# EAGLE design 32k extender-v1.1 (EAGLE 8.3.1)
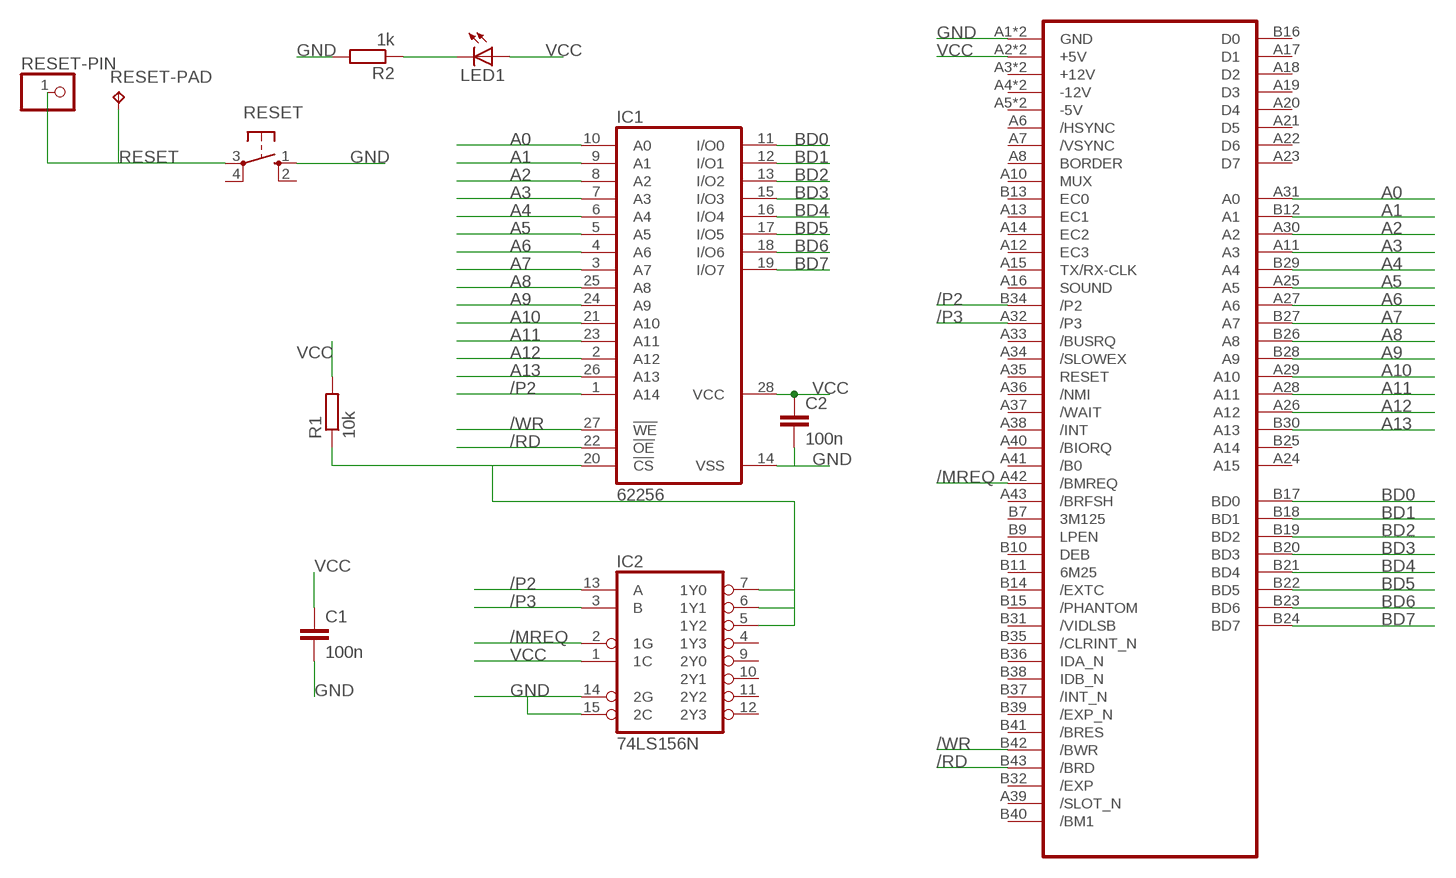
[diagram p0: schematic, sheet 1]

## Parts
C1  100n  C2.5/2  [C2.5-2]
C2  100n  C2.5/2  [C2.5-2]
IC1  62256  62256P  [DIL28-6]
IC2  74LS156N  [DIL16]
LED1  LED5MM  [LED5MM]
R1  10k  R-EU_0204/5  [0204/5]
R2  1k  R-EU_0204/5  [0204/5]
RESET  10-XX  [B3F-10XX]
RESET-PAD  TPTP13SQ  [TP13SQ]
RESET-PIN  PINHD-1X1  [1X01]
U$1  TVC-EXP-HBA  [TVC-EXP-EDGE]

## Nets
/MREQ: IC2.2(1G) U$1.A42(/BMREQ)
/P2: IC1.1(A14) IC2.13(A) U$1.B34(/P2)
/P3: IC2.3(B) U$1.A32(/P3)
/RD: IC1.22(!OE) U$1.B43(/BRD)
/WR: IC1.27(!WE) U$1.B42(/BWR)
A0: IC1.10(A0) U$1.A31(A0)
A1: IC1.9(A1) U$1.B12(A1)
A2: IC1.8(A2) U$1.A30(A2)
A3: IC1.7(A3) U$1.A11(A3)
A4: IC1.6(A4) U$1.B29(A4)
A5: IC1.5(A5) U$1.A25(A5)
A6: IC1.4(A6) U$1.A27(A6)
A7: IC1.3(A7) U$1.B27(A7)
A8: IC1.25(A8) U$1.B26(A8)
A9: IC1.24(A9) U$1.B28(A9)
A10: IC1.21(A10) U$1.A29(A10)
A11: IC1.23(A11) U$1.A28(A11)
A12: IC1.2(A12) U$1.A26(A12)
A13: IC1.26(A13) U$1.B30(A13)
BD0: IC1.11(I/O0) U$1.B17(BD0)
BD1: IC1.12(I/O1) U$1.B18(BD1)
BD2: IC1.13(I/O2) U$1.B19(BD2)
BD3: IC1.15(I/O3) U$1.B20(BD3)
BD4: IC1.16(I/O4) U$1.B21(BD4)
BD5: IC1.17(I/O5) U$1.B22(BD5)
BD6: IC1.18(I/O6) U$1.B23(BD6)
BD7: IC1.19(I/O7) U$1.B24(BD7)
GND [power]: C1.2 C2.2 IC1.14(VSS) IC2.14(2G) IC2.15(2C) R2.2 RESET.1(S) U$1.A1(GND) U$1.B1(GND)
N$1: IC1.20(!CS) IC2.5(1Y2) IC2.6(1Y1) IC2.7(1Y0) R1.1
N$3: LED1.K(C) R2.1
RESET: RESET-PAD.TP RESET-PIN.1 RESET.3(P)
VCC [power]: C1.1 C2.1 IC1.28(VCC) IC2.1(1C) LED1.A R1.2 U$1.A2(+5V) U$1.B2(+5V)
Unconnected: IC2.4(1Y3) IC2.9(2Y0) IC2.10(2Y1) IC2.11(2Y2) IC2.12(2Y3) RESET.2(S1) RESET.4(P1) U$1.A3(+12V) U$1.A4(-12V) U$1.A5(-5V) U$1.A6(/HSYNC) U$1.A7(/VSYNC) U$1.A8(BORDER) U$1.A10(MUX) U$1.A12(EC3) U$1.A13(EC1) U$1.A14(EC2) U$1.A15(TX/RX-CLK) U$1.A16(SOUND) U$1.A17(D1) U$1.A18(D2) U$1.A19(D3) U$1.A20(D4) U$1.A21(D5) U$1.A22(D6) U$1.A23(D7) U$1.A24(A15) U$1.A33(/BUSRQ) U$1.A34(/SLOWEX) U$1.A35(RESET) U$1.A36(/NMI) U$1.A37(/WAIT) U$1.A38(/INT) U$1.A39(/SLOT_N) U$1.A40(/BIORQ) U$1.A41(/B0) U$1.A43(/BRFSH) U$1.B3(+12V) U$1.B4(-12V) U$1.B5(-5V) U$1.B7(3M125) U$1.B9(LPEN) U$1.B10(DEB) U$1.B11(6M25) U$1.B13(EC0) U$1.B14(/EXTC) U$1.B15(/PHANTOM) U$1.B16(D0) U$1.B25(A14) U$1.B31(/VIDLSB) U$1.B32(/EXP) U$1.B35(/CLRINT_N) U$1.B36(IDA_N) U$1.B37(/INT_N) U$1.B38(IDB_N) U$1.B39(/EXP_N) U$1.B40(/BM1) U$1.B41(/BRES)

## Power pins joined to a net without a drawn wire
GND: IC2.8(GND)
VCC: IC2.16(VCC)

## Library data of the parts
C1 C2 = capacitor-wima:C: CAPACITOR naming: grid - package width
IC1 = memory-hitachi:62256P: MEMORY; OC_FARNELL: unknown; OC_NEWARK: unknown
IC2 = 74xx-eu:74*156: Dual 2-line to 4-line DECODER/DEMULTIPLEXER
LED1 = led:LED: LED OSRAM: - CHIPLED LG R971, LG N971, LY N971, LG Q971, LY Q971, LO R971, LY R971 LH N974, LH R974 LS Q976, LO Q976, LY Q976 LO Q996 - Hyper CHIPLED LW Q18S LB Q993, LB Q99A, LB R99A - SideLED LS A670, LO A670, LY A670, LG A670, LP A670 LB A673, LV A673, LT A673, LW A673 LH A674 LY A675 LS A676, LA A676, LO A676, LY A676, LW A676 LS A679, LY A679, LG A679 - Hyper Micro SIDELED® LS Y876, LA Y876, LO Y876, LY Y876 LT Y87S - SmartLED LW L88C, LW L88S LB L89C, LB L89S, LG L890 LS L89K, LO L89K, LY L89K LS L896, LA L896, LO L896, LY L896 - TOPLED LS T670, LO T670, LY T670, LG T670, LP T670 LSG T670, LSP T670, LSY T670, LOP T670, LYG T670 LG T671, LOG T671, LSG T671 LB T673, LV T673, LT T673, LW T673 LH T674 LS T676, LA T676, LO T676, LY T676, LB T676, LH T676, LSB T676, LW T676 LB T67C, LV T67C, LT T67C, LS T67K, LO T67K, LY T67K, LW E67C LS E67B, LA E67B, LO E67B, LY E67B, LB E67C, LV E67C, LT E67C LW T67C LS T679, LY T679, LG T679 LS T770, LO T770, LY T770, LG T770, LP T770 LB T773, LV T773, LT T773, LW T773 LH T774 LS E675, LA E675, LY E675, LS T675 LS T776, LA T776, LO T776, LY T776, LB T776 LHGB T686 LT T68C, LB T68C - Hyper Mini TOPLED® LB M676 - Mini TOPLED Santana® LG M470 LS M47K, LO M47K, LY M47K Source: http://www.osram.convergy.de LUXEON: - LUMILED® LXK2-PW12-R00, LXK2-PW12-S00, LXK2-PW14-U00, LXK2-PW14-V00 LXK2-PM12-R00, LXK2-PM12-S00, LXK2-PM14-U00 LXK2-PE12-Q00, LXK2-PE12-R00, LXK2-PE12-S00, LXK2-PE14-T00, LXK2-PE14-U00 LXK2-PB12-K00, LXK2-PB12-L00, LXK2-PB12-M00, LXK2-PB14-N00, LXK2-PB14-P00, LXK2-PB14-Q00 LXK2-PR12-L00, LXK2-PR12-M00, LXK2-PR14-Q00, LXK2-PR14-R00 LXK2-PD12-Q00, LXK2-PD12-R00, LXK2-PD12-S00 LXK2-PH12-R00, LXK2-PH12-S00 LXK2-PL12-P00, LXK2-PL12-Q00, LXK2-PL12-R00 Source: www.luxeon.com KINGBRIGHT: KA-3528ASYC Source: www.kingbright.com
R1 R2 = resistor:R-EU_: RESISTOR, European symbol
RESET = switch-omron:10-XX: OMRON SWITCH; MPN: B3F-1000; OC_FARNELL: 176432; OC_NEWARK: 36M3542
RESET-PAD = testpad:TP: Test pad
RESET-PIN = pinhead:PINHD-1X1: PIN HEADER
U$1 = tvc-exp:TVC-EXP-HBA: Videoton TV-Computer 32k and 64k expansion port edge connector

## Net classes
1 power: width 0.508 mm, clearance 0.254 mm

## Board
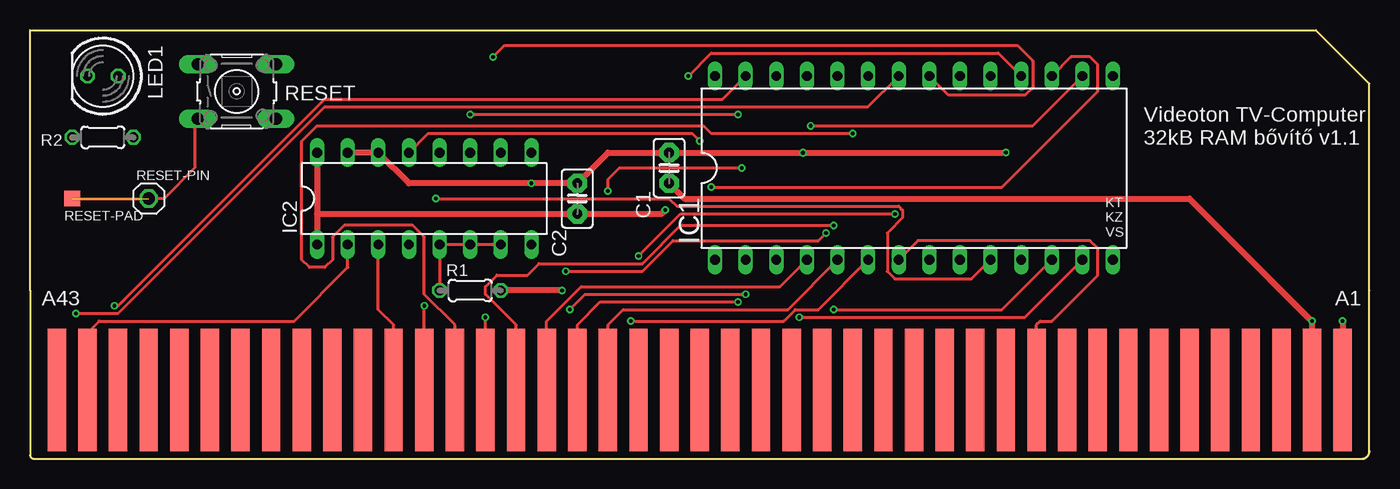
[diagram p1: board, top side]
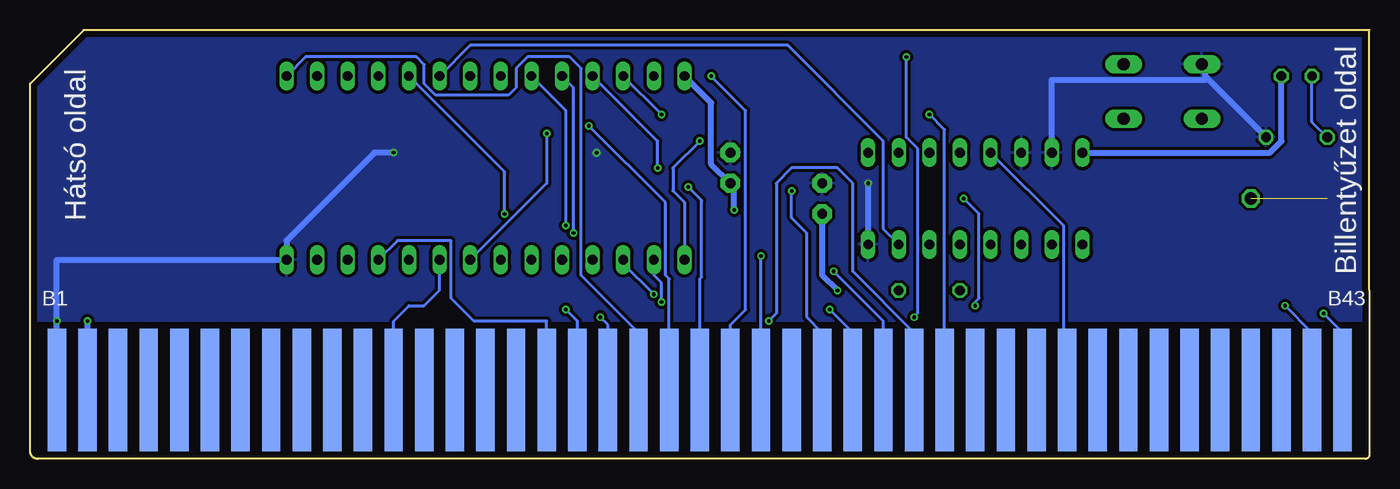
[diagram p2: board, bottom side, seen from below]

Size 111.12 x 35.56 mm. Coordinates in mm from the lower left corner, seen from the top.
Outline: 111.13,13.97 111.13,31.11 106.68,35.56 0,35.56 0,13.97
Copper layers (1*16): Top 0.035mm / dielectric 1.6mm / Bottom 0.035mm
Design rules "Elecrow_2-layer_PCB_eagle_rule *": minimum track width 10mil, minimum drill 12mil, track to track 6mil, track to pad 6mil, pad to pad 6mil, via to via 8mil, smd to smd 0mil, copper to edge 20mil, drill to drill 10mil, minimum pad ring 6mil, minimum via ring 6mil, stop-mask expansion 0mil, vias tented up to drill 100mil, thermal gap 10mil

### Footprints (pad centres in the part's own frame; a part is rotated, then mirrored left to right if it is on the bottom)
C2.5-2 = drill 0.813 pad 1.6 octagon: 1 -1.27,0; 2 1.27,0
DIL28-6 = drill 0.813 long: 1 -16.51,-7.62; 2 -13.97,-7.62; 3 -11.43,-7.62; 4 -8.89,-7.62; 5 -6.35,-7.62; 6 -3.81,-7.62; 7 -1.27,-7.62; 8 1.27,-7.62; 9 3.81,-7.62; 10 6.35,-7.62; 11 8.89,-7.62; 12 11.43,-7.62; 13 13.97,-7.62; 14 16.51,-7.62; 15 16.51,7.62; 16 13.97,7.62; 17 11.43,7.62; 18 8.89,7.62; 19 6.35,7.62; 20 3.81,7.62; 21 1.27,7.62; 22 -1.27,7.62; 23 -3.81,7.62; 24 -6.35,7.62; 25 -8.89,7.62; 26 -11.43,7.62; 27 -13.97,7.62; 28 -16.51,7.62
DIL16 = drill 0.813 long: 1 -8.89,-3.81; 2 -6.35,-3.81; 3 -3.81,-3.81; 4 -1.27,-3.81; 5 1.27,-3.81; 6 3.81,-3.81; 7 6.35,-3.81; 8 8.89,-3.81; 9 8.89,3.81; 10 6.35,3.81; 11 3.81,3.81; 12 1.27,3.81; 13 -1.27,3.81; 14 -3.81,3.81; 15 -6.35,3.81; 16 -8.89,3.81
LED5MM = drill 0.813 octagon: A -1.27,0; K 1.27,0
0204/5 = drill 0.813 octagon: 1 -2.54,0; 2 2.54,0
B3F-10XX = drill 1.016 long: 1 -3.251,2.261; 2 3.251,2.261; 3 -3.251,-2.261; 4 3.251,-2.261
TP13SQ = smd 1.3 x 1.3: TP 0,0
1X01 = drill 1.016 octagon: 1 0,0
TVC-EXP-EDGE = smd 1.524 x 10.16: A1 53.34,-5.715; A2 50.8,-5.715; A3 48.26,-5.715; A4 45.72,-5.715; A5 43.18,-5.715; A6 40.64,-5.715; A7 38.1,-5.715; A8 35.56,-5.715; A9 33.02,-5.715; A10 30.48,-5.715; A11 27.94,-5.715; A12 25.4,-5.715; A13 22.86,-5.715; A14 20.32,-5.715; A15 17.78,-5.715; A16 15.24,-5.715; A17 12.7,-5.715; A18 10.16,-5.715; A19 7.62,-5.715; A20 5.08,-5.715; A21 2.54,-5.715; A22 0,-5.715; A23 -2.54,-5.715; A24 -5.08,-5.715; A25 -7.62,-5.715; A26 -10.16,-5.715; A27 -12.7,-5.715; A28 -15.24,-5.715; A29 -17.78,-5.715; A30 -20.32,-5.715; A31 -22.86,-5.715; A32 -25.4,-5.715; A33 -27.94,-5.715; A34 -30.48,-5.715; A35 -33.02,-5.715; A36 -35.56,-5.715; A37 -38.1,-5.715; A38 -40.64,-5.715; A39 -43.18,-5.715; A40 -45.72,-5.715; A41 -48.26,-5.715; A42 -50.8,-5.715; A43 -53.34,-5.715 | smd 1.524 x 10.16 bottom: B1 53.34,-5.715; B2 50.8,-5.715; B3 48.26,-5.715; B4 45.72,-5.715; B5 43.18,-5.715; B6 40.64,-5.715; B7 38.1,-5.715; B8 35.56,-5.715; B9 33.02,-5.715; B10 30.48,-5.715; B11 27.94,-5.715; B12 25.4,-5.715; B13 22.86,-5.715; B14 20.32,-5.715; B15 17.78,-5.715; B16 15.24,-5.715; B17 12.7,-5.715; B18 10.16,-5.715; B19 7.62,-5.715; B20 5.08,-5.715; B21 2.54,-5.715; B22 0,-5.715; B23 -2.54,-5.715; B24 -5.08,-5.715; B25 -7.62,-5.715; B26 -10.16,-5.715; B27 -12.7,-5.715; B28 -15.24,-5.715; B29 -17.78,-5.715; B30 -20.32,-5.715; B31 -22.86,-5.715; B32 -25.4,-5.715; B33 -27.94,-5.715; B34 -30.48,-5.715; B35 -33.02,-5.715; B36 -35.56,-5.715; B37 -38.1,-5.715; B38 -40.64,-5.715; B39 -43.18,-5.715; B40 -45.72,-5.715; B41 -48.26,-5.715; B42 -50.8,-5.715; B43 -53.34,-5.715

### Placement (x,y rotation side)
C1  53.02,24.13 90 top
C2  45.4,21.59 90 top
IC1  73.34,24.13 0 top
IC2  32.7,21.59 0 top
LED1  6.03,31.75 180 top
R1  36.51,13.97 0 top
R2  6.03,26.67 0 top
RESET  17.15,30.48 0 top
RESET-PAD  3.49,21.59 0 top
RESET-PIN  9.84,21.59 0 top
U$1  55.56,11.43 0 top

### Tracks (layer width: path | path; a pad name or v marks a point on that pad's centre or on a via)
/MREQ
  Top 0.254: IC2.2 26.35,15.88 21.91,11.43 5.71,11.43 4.76,10.48 U$1.A42
/P2  (via drill 0.3)
  Top 0.254: v55.56,26.35 54.93,26.99 33.02,26.99 IC2.13
  Bottom 0.254: IC1.1 56.83,21.27 57.78,22.23 57.78,24.13 v55.56,26.35 | IC2.13 25.4,19.37 25.4,5.71 25.08,5.4 U$1.B34
/P3
  Top 0.254: IC2.3 28.89,12.38 30.16,11.11 U$1.A32
/RD  (via drill 0.3)
  Top 0.254: IC1.22 69.53,29.21 24.45,29.21 7.3,12.06 v3.81,12.06
  Bottom 0.254: v3.81,12.06 2.22,10.48 U$1.B43
/WR  (via drill 0.3)
  Top 0.254: IC1.27 57.47,29.84 24.45,29.84 7.3,12.7 v6.98,12.7
  Bottom 0.254: v6.98,12.7 4.76,10.48 U$1.B42
A0  (via drill 0.3)
  Top 0.254: IC1.10 78.11,14.92 71.75,14.92 71.12,15.56 71.12,18.73 72.39,20 72.39,20.64 72.07,20.95 53.66,20.95 53.02,21.59 v33.66,21.59 | v32.7,12.7 32.7,9.53 32.38,5.4 32.7,5.4 U$1.A31
  Bottom 0.254: v33.66,21.59 32.38,20.32 32.38,13.34 32.7,13.02 v32.7,12.7
A1
  Bottom 0.254: IC1.9 77.15,13.97 78.42,12.7 79.69,12.7 80.96,11.43 U$1.B12
A2  (via drill 0.3)
  Top 0.254: v68.26,26.99 56.52,26.99 55.88,27.62 23.81,27.62 22.54,26.35 22.54,16.51 23.18,15.88 24.45,15.88 25.08,16.51 25.08,18.41 26.03,19.37 31.75,19.37 32.7,18.41 32.7,13.65 35.24,11.11 U$1.A30
  Bottom 0.254: IC1.8 68.26,22.86 v68.26,26.99
A3
  Top 0.254: IC1.7 73.66,18.1 87.95,18.1 88.58,17.46 88.58,15.24 84.77,11.43 83.82,11.43 83.5,11.11 U$1.A11
A4  (via drill 0.3)
  Top 0.254: IC1.6 65.41,12.38 63.5,12.38 62.55,11.43 v49.85,11.43
  Bottom 0.254: v49.85,11.43 49.21,12.06 49.21,22.86 47.94,24.13 44.13,24.13 42.86,22.86 42.86,15.56 37.78,10.48 U$1.B29
A5
  Top 0.254: IC1.5 62.86,12.38 49.21,12.38 47.94,11.11 U$1.A25
A6
  Top 0.254: IC1.4 62.23,14.29 45.72,14.29 42.86,11.43 U$1.A27
A7  (via drill 0.3)
  Top 0.254: v44.77,12.38 46.04,13.65 v59.37,13.65
  Bottom 0.254: IC1.3 61.91,16.19 v59.37,13.65 | v44.77,12.38 42.86,10.48 U$1.B27
A8  (via drill 0.3)
  Top 0.254: v59.06,24.13 48.89,24.13 47.94,23.18 v47.94,22.23
  Bottom 0.254: IC1.25 59.06,26.35 v59.06,24.13 | v47.94,22.23 47.94,20 46.67,18.73 46.67,11.75 45.4,10.48 U$1.B26
A9  (via drill 0.3)
  Top 0.254: v66.04,18.73 65.41,18.1 53.34,18.1 50.8,15.56 v44.45,15.56
  Bottom 0.254: IC1.24 66.04,30.8 v66.04,18.73 | v44.45,15.56 40.32,11.43 U$1.B28
A10  (via drill 0.3)
  Top 0.254: IC1.21 76.2,30.16 82.55,30.16 83.19,30.8 83.19,33.02 81.91,34.29 39.37,34.29 v38.42,33.34 | v37.78,11.75 37.78,8.89 37.15,5.4 37.78,5.4 U$1.A29
  Bottom 0.254: v38.42,33.34 38.42,26.67 37.46,25.72 37.46,12.06 v37.78,11.75
A11  (via drill 0.3)
  Top 0.254: v66.67,19.37 53.98,19.37 50.8,16.19 42.23,16.19 41.28,15.24 38.74,15.24 37.78,14.29 37.78,13.65 40.32,11.11 U$1.A28
  Bottom 0.254: IC1.23 66.67,28.89 v66.67,19.37
A12  (via drill 0.3)
  Top 0.254: v58.74,13.02 47.31,13.02 45.4,11.11 U$1.A26
  Bottom 0.254: IC1.2 59.37,15.24 58.74,14.61 v58.74,13.02
A13  (via drill 0.3)
  Top 0.254: v36.51,28.57 v58.74,28.57
  Bottom 0.254: v58.74,28.57 IC1.26 | v36.51,28.57 35.24,27.3 35.24,10.16 35.56,5.71 35.24,5.4 U$1.B30
BD0
  Bottom 0.254: IC1.11 80.64,18.1 76.2,18.1 76.2,13.34 74.3,11.43 68.26,11.43 U$1.B17
BD1  (via drill 0.3)
  Top 0.254: IC1.12 80.64,12.38 v66.67,12.38
  Bottom 0.254: v66.67,12.38 65.72,11.43 U$1.B18
BD2  (via drill 0.3)
  Top 0.254: IC1.13 82.55,11.75 v63.82,11.75
  Bottom 0.254: v63.82,11.75 63.18,11.11 U$1.B19
BD3
  Bottom 0.254: IC1.15 88.27,33.34 79.06,33.34 78.42,32.7 78.42,31.11 77.47,30.16 71.44,30.16 70.8,30.8 70.8,32.38 69.85,33.34 66.36,33.34 65.41,32.38 65.41,15.24 60.64,10.48 U$1.B20
BD4  (via drill 0.3)
  Top 0.254: IC1.16 83.19,27.62 v64.77,27.62
  Bottom 0.254: v64.77,27.62 58.42,21.27 58.42,15.24 58.1,14.92 U$1.B21
BD5  (via drill 0.3)
  Top 0.254: IC1.17 86.36,33.34 87.95,33.34 88.58,32.7 88.58,30.48 80.64,22.54 v56.52,22.54
  Bottom 0.254: v56.52,22.54 55.4,21.43 55.4,15.08 55.56,14.92 U$1.B22
BD6  (via drill 0.3)
  Top 0.254: IC1.18 80.33,33.66 56.52,33.66 v54.61,31.75
  Bottom 0.254: v54.61,31.75 51.75,28.89 51.75,12.38 53.02,11.11 U$1.B23
BD7  (via drill 0.3)
  Top 0.254: v71.75,20.32 53.98,20.32 v50.48,16.83
  Bottom 0.254: IC1.19 71.75,23.81 v71.75,20.32 | U$1.B24 v50.48,16.83
GND  (via drill 0.3, 0.35)
  Top 0.508: v108.9,11.43 U$1.B1 | IC2.15 IC2.14 31.43,22.86 v41.59,22.86 C2.2 47.94,25.4 C1.2 v64.14,25.4 v80.96,25.4
  Bottom 0.508: U$1.B1 v108.9,11.43 108.9,16.51 IC1.14 89.85,18.1 82.55,25.4 v80.96,25.4 | 13.49,31.59 13.65,31.75 13.65,32.7 RESET.1 | 13.49,31.59 R2.2 | v41.59,22.86 IC2.8 | IC2.15 26.35,31.43 13.65,31.43 13.49,31.59
  pour Bottom: -0.32,36.2 -0.32,11.43 111.76,11.43 111.76,35.56 111.12,36.2
N$1
  Top 0.254: R1.1 IC2.5 IC2.6 IC2.7
  Bottom 0.254: IC1.20 74.61,34.29 48.26,34.29 40.32,26.35 40.32,19.05 IC2.7
N$3
  Bottom 0.254: R2.1 4.76,27.94 LED1.K
RESET  (1 unrouted)
  Top 0.254: RESET.3 13.65,27.94 13.65,24.13 11.11,21.59 RESET-PIN.1 RESET-PAD.TP
VCC  (via drill 0.3)
  Top 0.508: U$1.B2 v106.36,11.43 96.2,21.59 54.29,21.59 C1.1 | v44.13,13.97 R1.2 | IC2.16 23.81,20.32 | 23.81,20.32 IC2.1 | 23.81,20.32 C2.1 52.39,20.32 v52.7,20.64
  Bottom 0.508: U$1.B2 v106.36,11.43 | IC1.28 54.61,29.53 54.61,24.45 C1.1 52.7,22.54 v52.7,20.64 | v44.13,13.97 45.4,15.24 C2.1 | IC2.16 8.26,25.4 7.3,26.35 LED1.A

### Text on the board
tPlace: Videoton TV-Computer / 32kB RAM bővítő v1.1 | KT / KZ / VS
bPlace: Billentyűzet oldal | Hátsó oldal